# Altium schematic sheet Smart_home.SchDoc
size A4; SheetNumber: 1; SheetTotal: 1
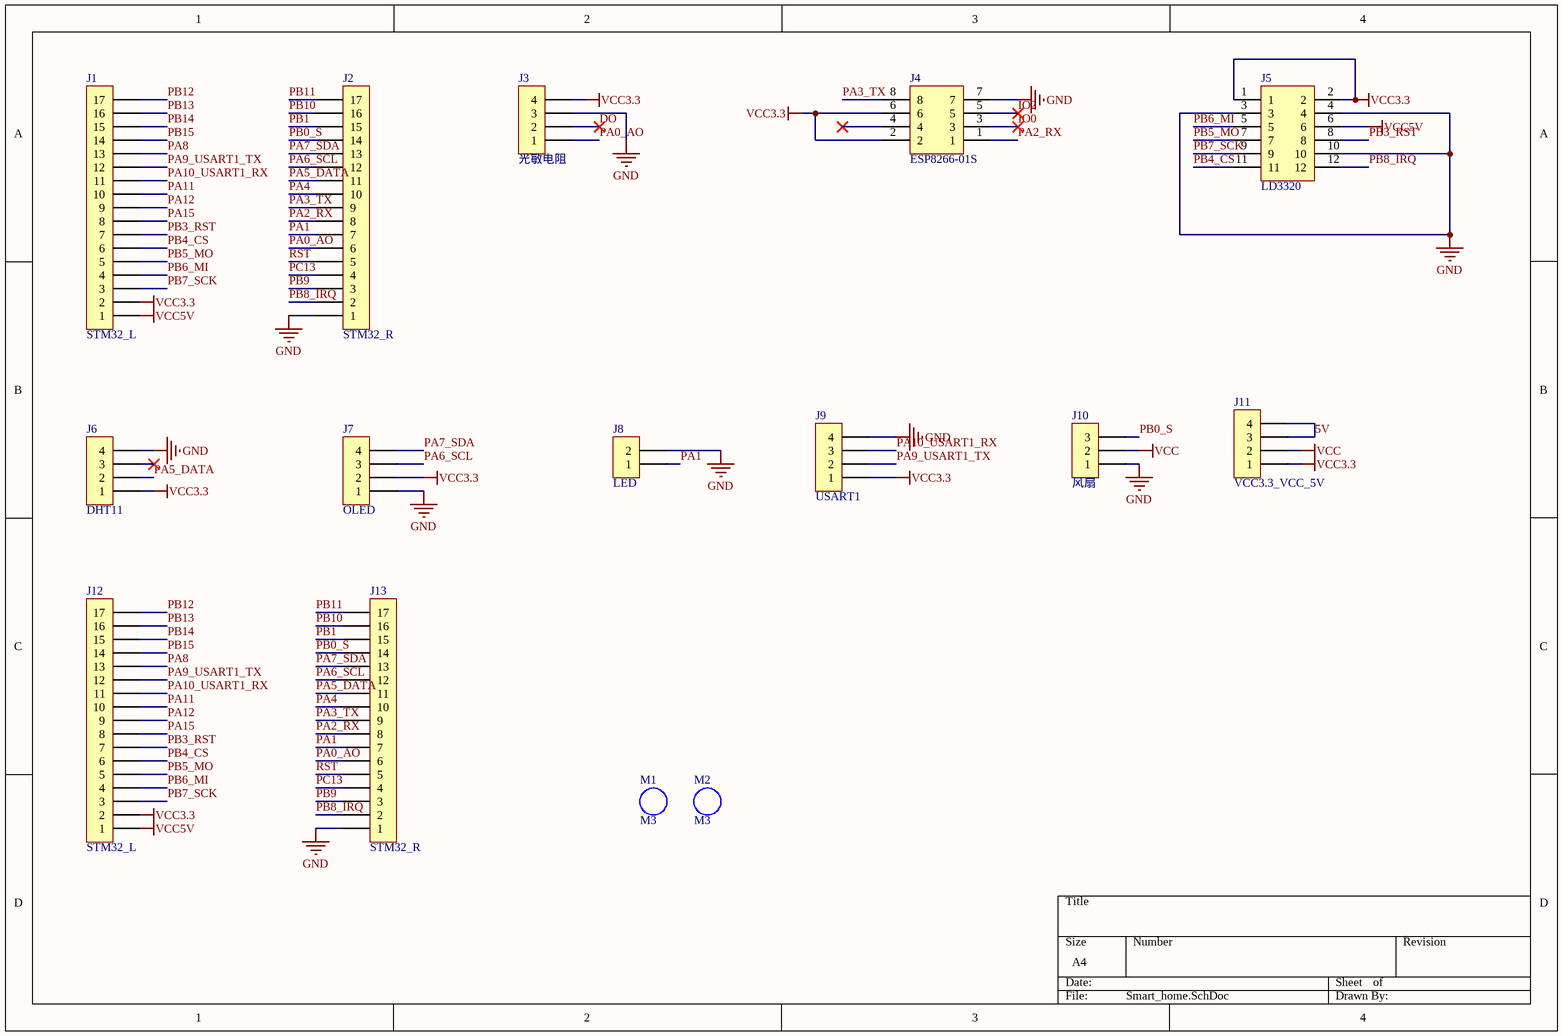
[diagram p0: Smart_home.SchDoc]

## Parts
J1  STM32_L  [Fe-HDR1X17/2.54-S]
J2  STM32_R  [Fe-HDR1X17/2.54-S]
J3  光敏电阻  [Fe-HDR1X4/2.54-S]
J4  ESP8266-01S  [Fe-HDR2X4/2.54-S]
J5  LD3320  [Fe-HDR2X6/2.54-S]
J6  DHT11  [Fe-HDR1X4/2.54-S]
J7  OLED  [Fe-HDR1X4/2.54-S]
J8  LED  [Fe-HDR1X2/2.54-S]
J9  USART1  [Fe-HDR1X4/2.54-S]
J10  风扇  [Pin HDR1X3/2.54mm-S]
J11  VCC3.3_VCC_5V  [Pin HDR1X4/2.54mm-S]
J12  STM32_L  [Fe-HDR1X17/2.54-S]
J13  STM32_R  [Fe-HDR1X17/2.54-S]
M1  M3  [M3 125X300]
M2  M3  [M3 125X300]

## Nets
GND: J2.1 J3.3 J4.7 J5.3 J5.4 J5.10 J6.4 J7.1 J8.2 J9.4 J10.1 J13.1
VCC: J10.2 J11.2
VCC3.3: J1.2 J3.4 J4.2 J4.6 J5.1 J5.2 J6.1 J7.2 J9.1 J11.1 J12.2
VCC5V: J1.1 J5.6 J12.1
5V: J11.3 J11.4
DO: J3.2
IO0: J4.3
IO2: J4.5
PA0_AO: J2.6 J3.1 J13.6
PA1: J2.7 J8.1 J13.7
PA2_RX: J2.8 J4.1 J13.8
PA3_TX: J2.9 J4.8 J13.9
PA4: J2.10 J13.10
PA5_DATA: J2.11 J6.2 J13.11
PA6_SCL: J2.12 J7.3 J13.12
PA7_SDA: J2.13 J7.4 J13.13
PA8: J1.13 J12.13
PA9_USART1_TX: J1.12 J9.2 J12.12
PA10_USART1_RX: J1.11 J9.3 J12.11
PA11: J1.10 J12.10
PA12: J1.9 J12.9
PA15: J1.8 J12.8
PB0_S: J2.14 J10.3 J13.14
PB1: J2.15 J13.15
PB3_RST: J1.7 J5.8 J12.7
PB4_CS: J1.6 J5.11 J12.6
PB5_MO: J1.5 J5.7 J12.5
PB6_MI: J1.4 J5.5 J12.4
PB7_SCK: J1.3 J5.9 J12.3
PB8_IRQ: J2.2 J5.12 J13.2
PB9: J2.3 J13.3
PB10: J2.16 J13.16
PB11: J2.17 J13.17
PB12: J1.17 J12.17
PB13: J1.16 J12.16
PB14: J1.15 J12.15
PB15: J1.14 J12.14
PC13: J2.4 J13.4
RST: J2.5 J13.5

Not connected (* = marked no-connect by the designer): J4 4*; J6 3*

## Library data of the parts
J1 J2 J12 J13 = Female HDR1X17
J3 J6 J7 J9 = Female HDR1X4
J4 = Female HDR2X4
J5 = Female HDR2X6
J8 = Female HDR1X2
J10 = Pin HDR1X3
J11 = Pin HDR1X4
M1 M2 = M3: 铜柱孔; 版权归属: 源创客; BOM名称: 铜柱孔; 学习资源: www.ooocke.com